# EAGLE design M5_Access_Switch_Dual_Input (EAGLE 9.6.2)
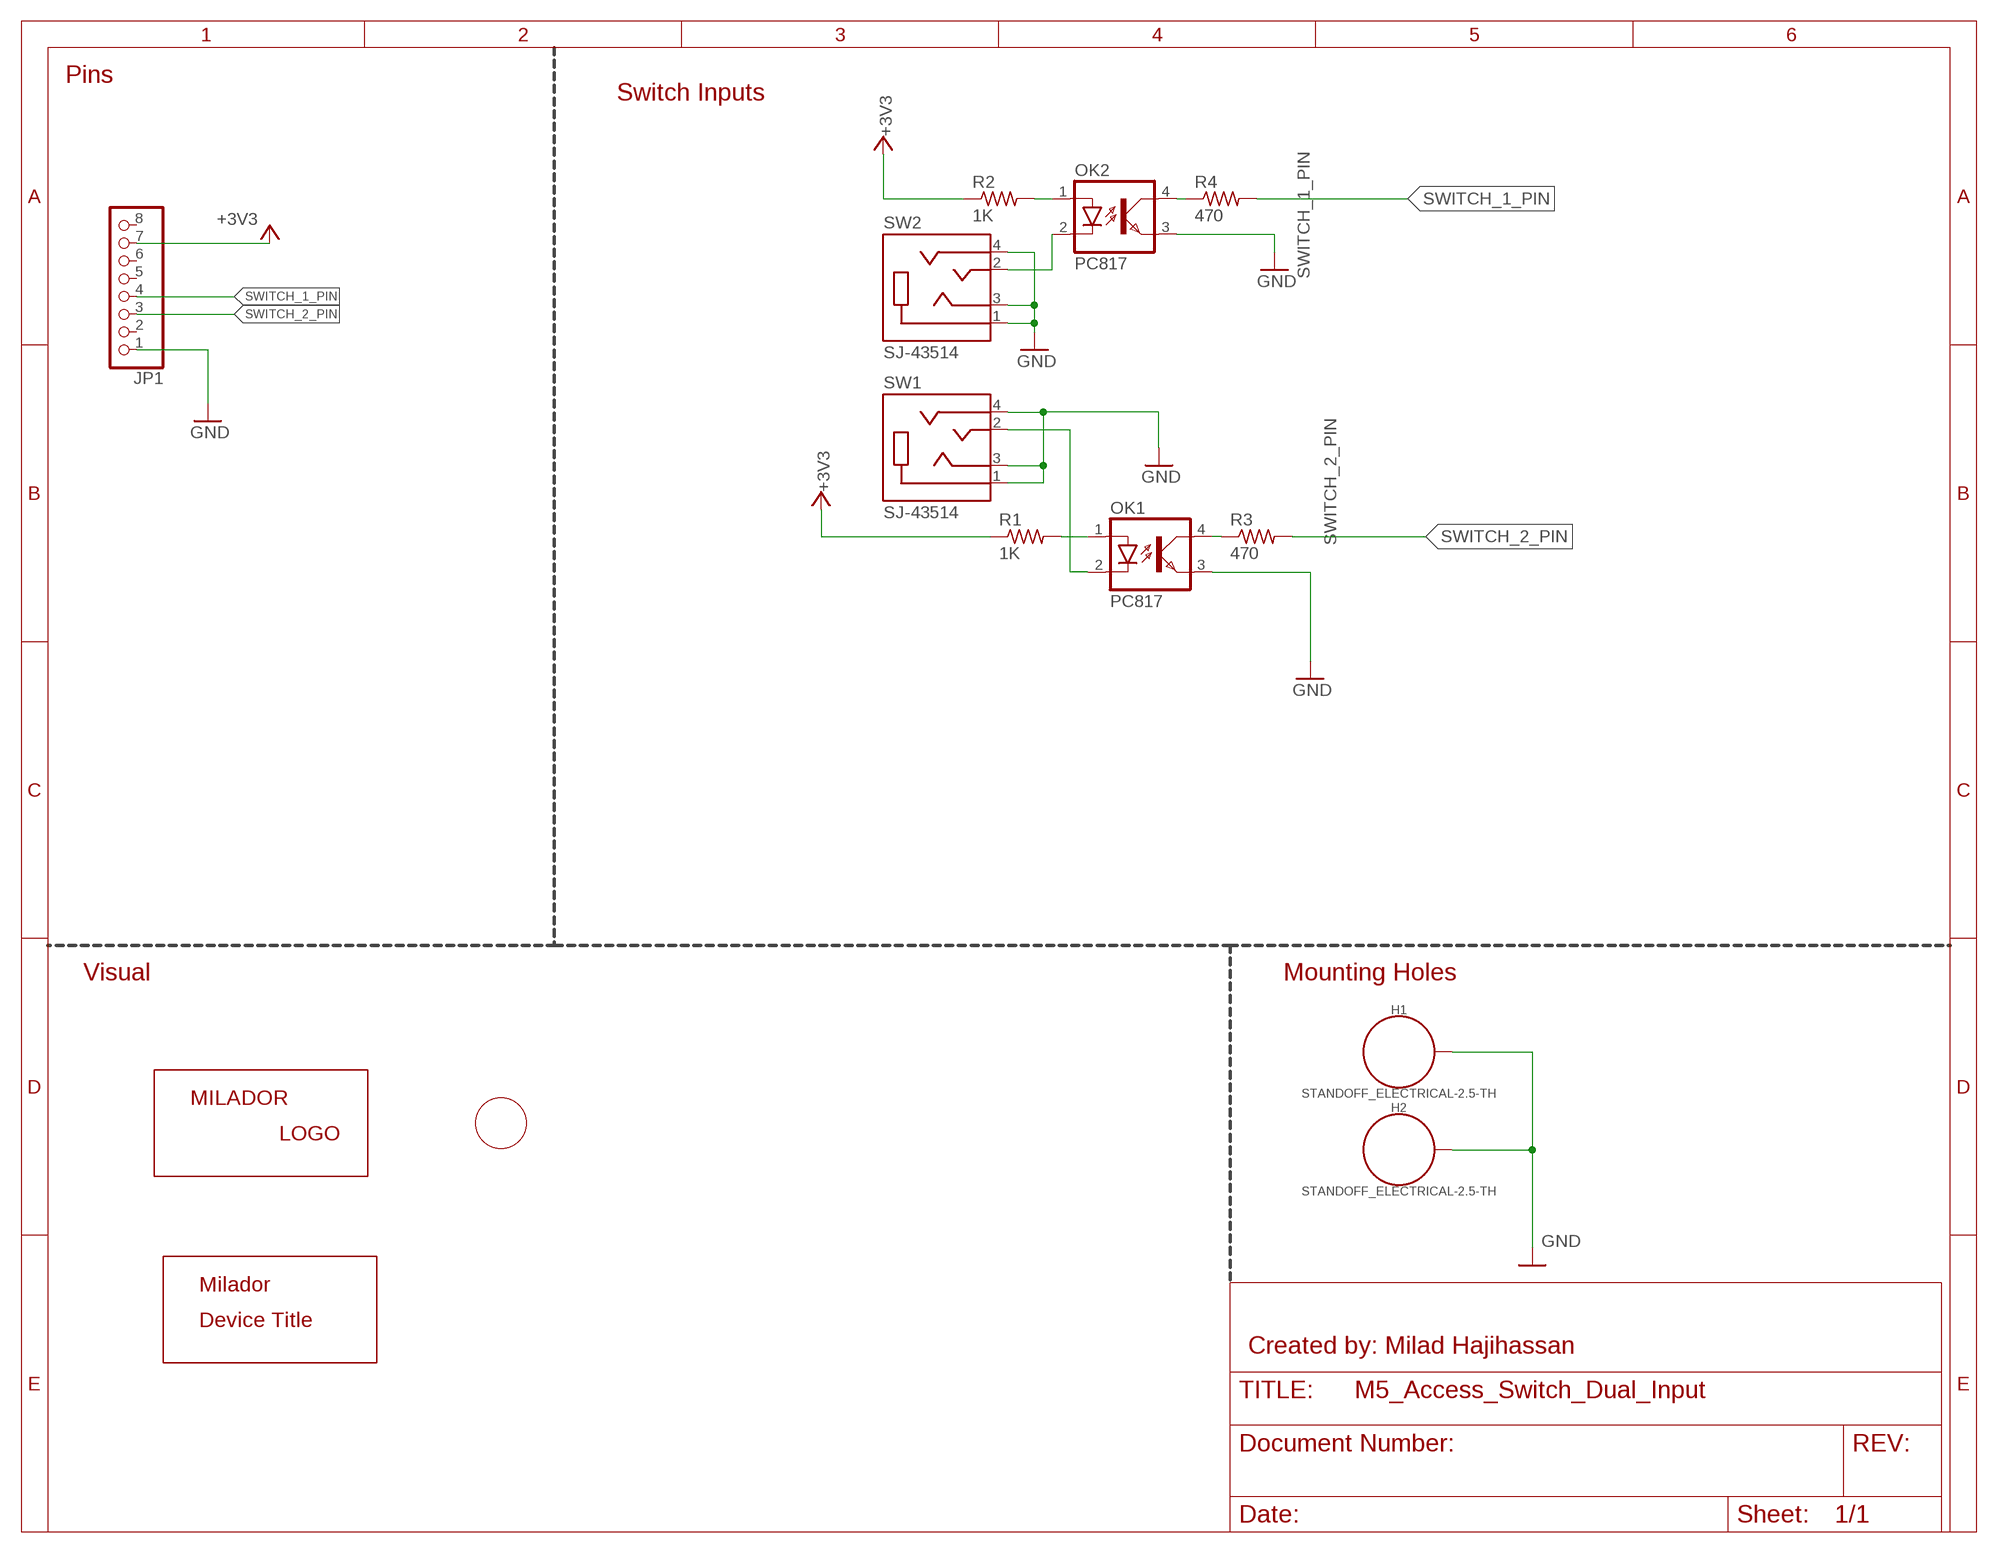
[diagram p0: schematic, sheet 1]

## Parts
H1  STANDOFF_ELECTRICAL-2.5-TH  [STANDOFF-ELECTRICAL-2.5-TH]
H2  STANDOFF_ELECTRICAL-2.5-TH  [STANDOFF-ELECTRICAL-2.5-TH]
JP1  HEADER_MALE-1X8ROUND-RA  [1X08_ROUND_RA]
LABEL_DEVICE_TOP  MILADOR-DEVICE-M5-ACCESS-SWITCH  [MILADOR_M5_ACCESS_SWITCH]
LABEL_INPUT_TOP  MILADOR-SWITCH-NAME-SW-INPUT  [SWITCH-INPUT]
LABEL_LOGO_TOP  MILADOR-LOGO-SM  [MILADOR_LOGO2]
OK1  PC817  [DIL04]
OK2  PC817  [DIL04]
R1  1K  RESISTOR-US-0204/5  [RESISTOR_0204/5]
R2  1K  RESISTOR-US-0204/5  [RESISTOR_0204/5]
R3  470  RESISTOR-US-0204/5  [RESISTOR_0204/5]
R4  470  RESISTOR-US-0204/5  [RESISTOR_0204/5]
SW1  SJ-43514  [CUI_SJ-43514]
SW2  SJ-43514  [CUI_SJ-43514]

## Nets
+3V3: JP1.7 R1.1 R2.1
GND: H1.P1 H2.P1 JP1.1 OK1.3(EMIT) OK2.3(EMIT) SW1.1(SLEEVE) SW1.3(RING1) SW1.4(RING2) SW2.1(SLEEVE) SW2.3(RING1) SW2.4(RING2)
N$1: OK1.1(A) R1.2
N$2: OK1.4(COL) R3.1
N$3: OK1.2(C) SW1.2(TIP)
N$14: OK2.1(A) R2.2
N$20: OK2.4(COL) R4.1
N$23: OK2.2(C) SW2.2(TIP)
SWITCH_1_PIN: JP1.4 R4.2
SWITCH_2_PIN: JP1.3 R3.2
Unconnected: JP1.2 JP1.5 JP1.6 JP1.8

## Notes on the sheet
- Pins
- Switch Inputs
- Visual | Mounting Holes
- Created by: Milad Hajihassan

## Library data of the parts
H1 H2 = milador:STANDOFF_ELECTRICAL: Stand Off Drill holes with an electrical connection. For example, use these to ground your board to a chassis. Example SparkFun Products Screw - Phillips Head (1/4", 4-40, 10 pack) <https://www.sparkfun.com/products/10453> (PRT-10453) Screw - Phillips Head (1/2", 4-40, 10 pack) <https://www.sparkfun.com/products/10452> (PRT-10452) Screw - Phillips Head (3/4", 4-40, 10 pack) <https://www.sparkfun.com/products/10451> (PRT-10451) Screw - Phillips Head (1", 4-40, 10 pack) <https://www.sparkfun.com/products/10450> (PRT-10450)
JP1 = milador:HEADER_MALE-1X8: PIN HEADER
LABEL_DEVICE_TOP = milador:MILADOR-DEVICE-
LABEL_INPUT_TOP = milador:MILADOR-SWITCH-NAME-
LABEL_LOGO_TOP = milador:MILADOR-LOGO-
OK1 OK2 = milador:PC817: SHARP OPTO COUPLER
R1-R4 = milador:RESISTOR-US-: RESISTOR, American symbol
SW1 SW2 = milador:SJ-43514

## Board
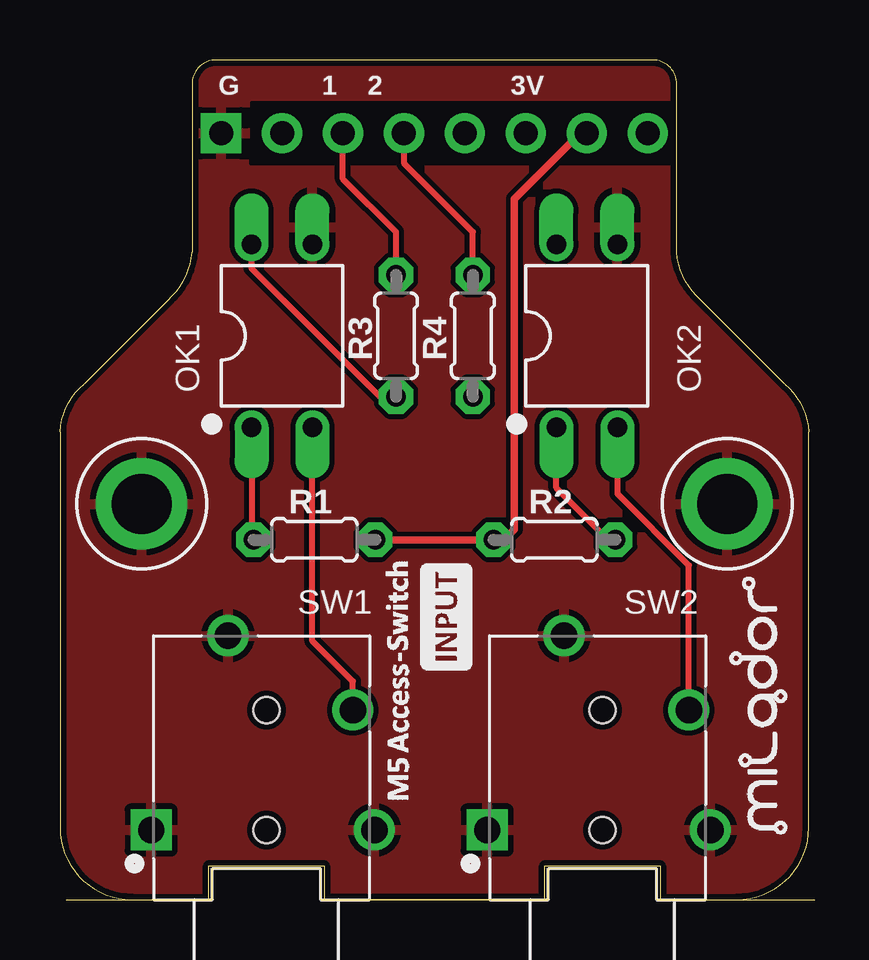
[diagram p1: board, top side]
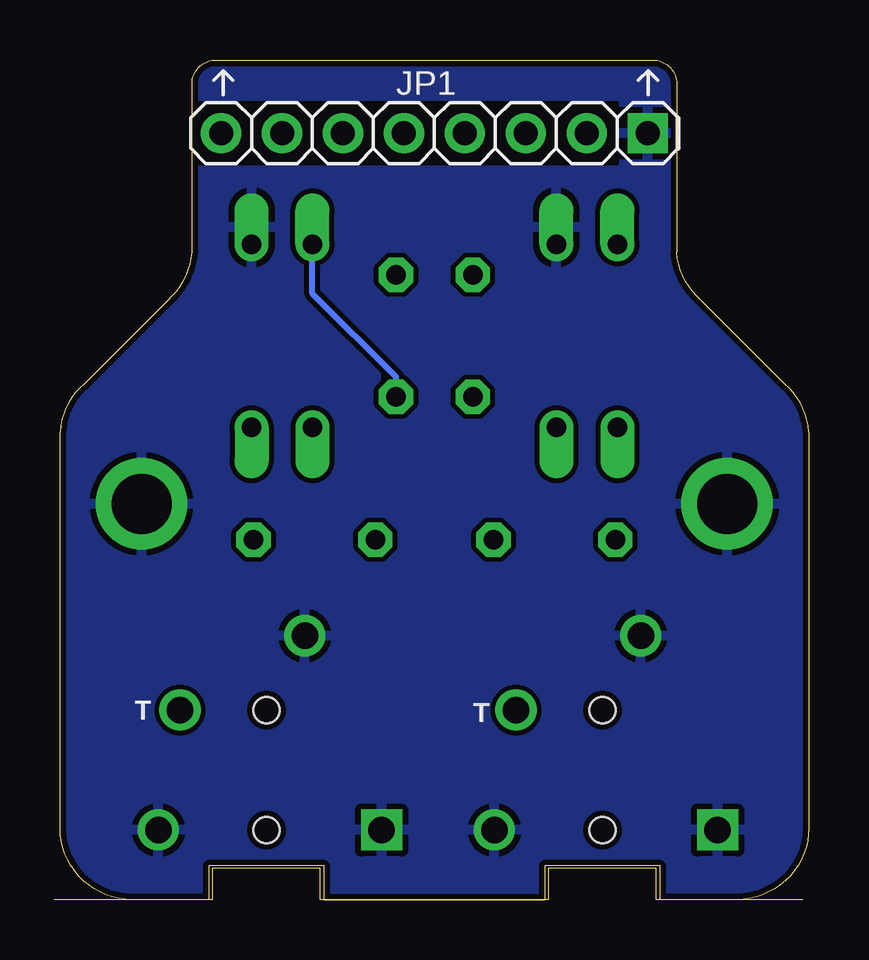
[diagram p2: board, bottom side, seen from below]

Size 31.2 x 35 mm. Coordinates in mm from the lower left corner, seen from the top.
Outline: 3,0 6.2,0 6.2,1.4 11,1.4 11,0 20.2,0 20.2,1.4 25,1.4 25,0 28.2,0 arc90 31.2,3 31.2,19.5 arc45 30.2,21.5 26.7,25 arc-45 25.7,27 25.7,34 arc90 24.7,35 6.5,35 arc90 5.5,34 5.5,27 arc-45 4.5,25 1,21.5 arc45 0,19.5 0,3 arc90 3,0
Copper layers (1*16): Top 0.035mm / dielectric 1.5mm / Bottom 0.035mm
Design rules "SparkFun": minimum track width 8mil, minimum drill 20mil, track to track 8mil, track to pad 8mil, pad to pad 8mil, via to via 8mil, smd to smd 8mil, copper to edge 10mil, drill to drill 8mil, minimum pad ring 12mil, minimum via ring 10mil, stop-mask expansion 4mil, vias tented up to drill 25mil, thermal gap 10mil

### Footprints (pad centres in the part's own frame; a part is rotated, then mirrored left to right if it is on the bottom)
STANDOFF-ELECTRICAL-2.5-TH = drill 2.5 pad 3.81: P1 0,0
1X08_ROUND_RA = drill 1 pad 1.676 square: 1 -8.89,0 | drill 1 pad 1.676: 2 -6.35,0; 3 -3.81,0; 4 -1.27,0; 5 1.27,0; 6 3.81,0; 7 6.35,0; 8 8.89,0
DIL04 = drill 0.813 offset: 1 -1.27,-3.81; 2 1.27,-3.81; 3 1.27,3.81; 4 -1.27,3.81
RESISTOR_0204/5 = drill 0.813 octagon: 1 -2.54,0; 2 2.54,0
CUI_SJ-43514 = drill 1.1 square: 1 -2.6,4.8 | drill 1.1: 2 2.4,-3.6; 3 5.5,1.6; 4 -2.6,-4.5 | hole 1.1: -2.6,0; 2.4,0

### Placement (x,y rotation side)
H1  3.4,16.5 0 top
H2  27.8,16.5 90 top
JP1  15.6,31.95 180 bottom
LABEL_DEVICE_TOP  14.2,9.1 90 top
LABEL_INPUT_TOP  16.1,11.8 90 top
LABEL_LOGO_TOP  29.6,7.4 90 top
OK1  9.25,23.5 0 top
OK2  21.95,23.5 0 top
R1  10.6,15 180 top
R2  20.6,15 0 top
R3  14,23.5 90 top
R4  17.2,23.5 90 top
SW1  8.6,5.5 90 top
SW2  22.6,5.5 90 top

### Tracks (layer width: path | path; a pad name or v marks a point on that pad's centre or on a via)
+3V3
  Top 0.305: JP1.7 21.68,31.95 18.93,29.2 18.93,15.43 18.5,15 R2.1 R1.1
GND
  pour Bottom: 3,0 28.2,0 arc90 31.2,3 31.2,20.5 31.2,35 25.7,35 5.5,35 0,35 0,20.5 0,3 arc90
  pour Top: 3,0 28.2,0 arc90 31.2,3 31.2,20.5 31.2,35 0,35 0,29.5 0,3 arc90
  cutout Top: 7.98,30.67 7.98,33.22 25.7,33.22 25.7,30.68 7.94,30.68
  cutout Bottom: 7.98,33.22 25.7,33.22 25.7,30.68 7.98,30.68
N$1
  Top 0.254: R1.2 8.06,15.46 7.98,15.53 7.98,19.66 OK1.1
N$2
  Top 0.254: R3.1 13.33,20.96 7.98,26.31 OK1.4
N$3
  Top 0.254: SW1.2 12.2,9.1 10.52,10.78 OK1.2
N$14
  Top 0.254: R2.2 22.84,15 20.68,17.16 OK2.1
N$20
  Bottom 0.254: R4.1 17.2,21.79 20.68,25.27 OK2.4
N$23
  Top 0.254: SW2.2 26.2,13.94 23.22,16.92 OK2.2
SWITCH_1_PIN
  Top 0.254: R4.2 17.2,27.83 14.33,30.7 JP1.4
SWITCH_2_PIN
  Top 0.254: R3.2 14,27.82 11.79,30.03 JP1.3

### Text on the board
tPlace: G 1 2 3V
bPlace: T | T